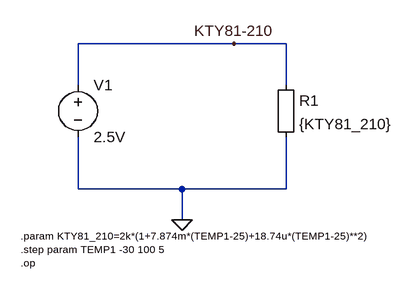
[diagram p0: schematic bridge_op_1.asc]
bridge_op_1.asc, the LTspice schematic file:
Version 4
SHEET 1 1020 680
WIRE 448 224 208 224
WIRE 528 224 448 224
WIRE 208 288 208 224
WIRE 528 288 528 224
WIRE 208 448 208 368
WIRE 368 448 208 448
WIRE 528 448 528 368
WIRE 528 448 368 448
WIRE 368 496 368 448
FLAG 368 496 0
FLAG 448 224 KTY81-210
SYMBOL Misc/EuropeanResistor 512 272 R0
SYMATTR InstName R1
SYMATTR Value {KTY81_210}
SYMBOL voltage 208 272 R0
SYMATTR InstName V1
SYMATTR Value 2.5V
TEXT 120 520 Left 1 !.param KTY81_210=2k*(1+7.874m*(TEMP1-25)+18.74u*(TEMP1-25)**2)\n.step param TEMP1 -30 100 5\n.op

The netlist it stands for:
* bridge_op_1.asc
R1 KTY81-210 0 {KTY81_210}
V1 KTY81-210 0 2.5V
.param KTY81_210=2k*(1+7.874m*(TEMP1-25)+18.74u*(TEMP1-25)**2)
.step param TEMP1 -30 100 5
.op
.backanno
.end